# EAGLE schematic sender_einfach_12v (EAGLE 7.1.0)
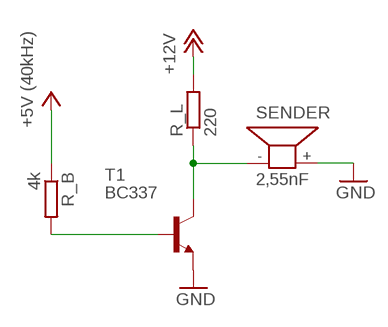
[diagram p0: schematic, sheet 1]

## Parts
R_B  4k  R-EU_0309/12  [0309/12]
R_L  220  R-EU_0309/12  [0309/12]
SENDER  2,55nF  AL11P  [AL11P]
T1  BC337  [TO92]

## Nets
+12V: R_L.2
GND: SENDER.+ T1.1(E)
N$1: R_B.2 T1.2(B)
PWM: R_B.1 ; supply symbol labelled +5V (40kHz)
R_L: R_L.1 SENDER.- T1.3(C)

## Library data of the parts
R_B R_L = rcl:R-EU_: RESISTOR, European symbol
SENDER = buzzer:AL11P: SPEAKER Source: Buerklin; OC_FARNELL: unknown; OC_NEWARK: unknown
T1 = transistor:BC337: NPN TRANSISTOR